# Altium schematic sheet Power Stuff.SchDoc
size A4
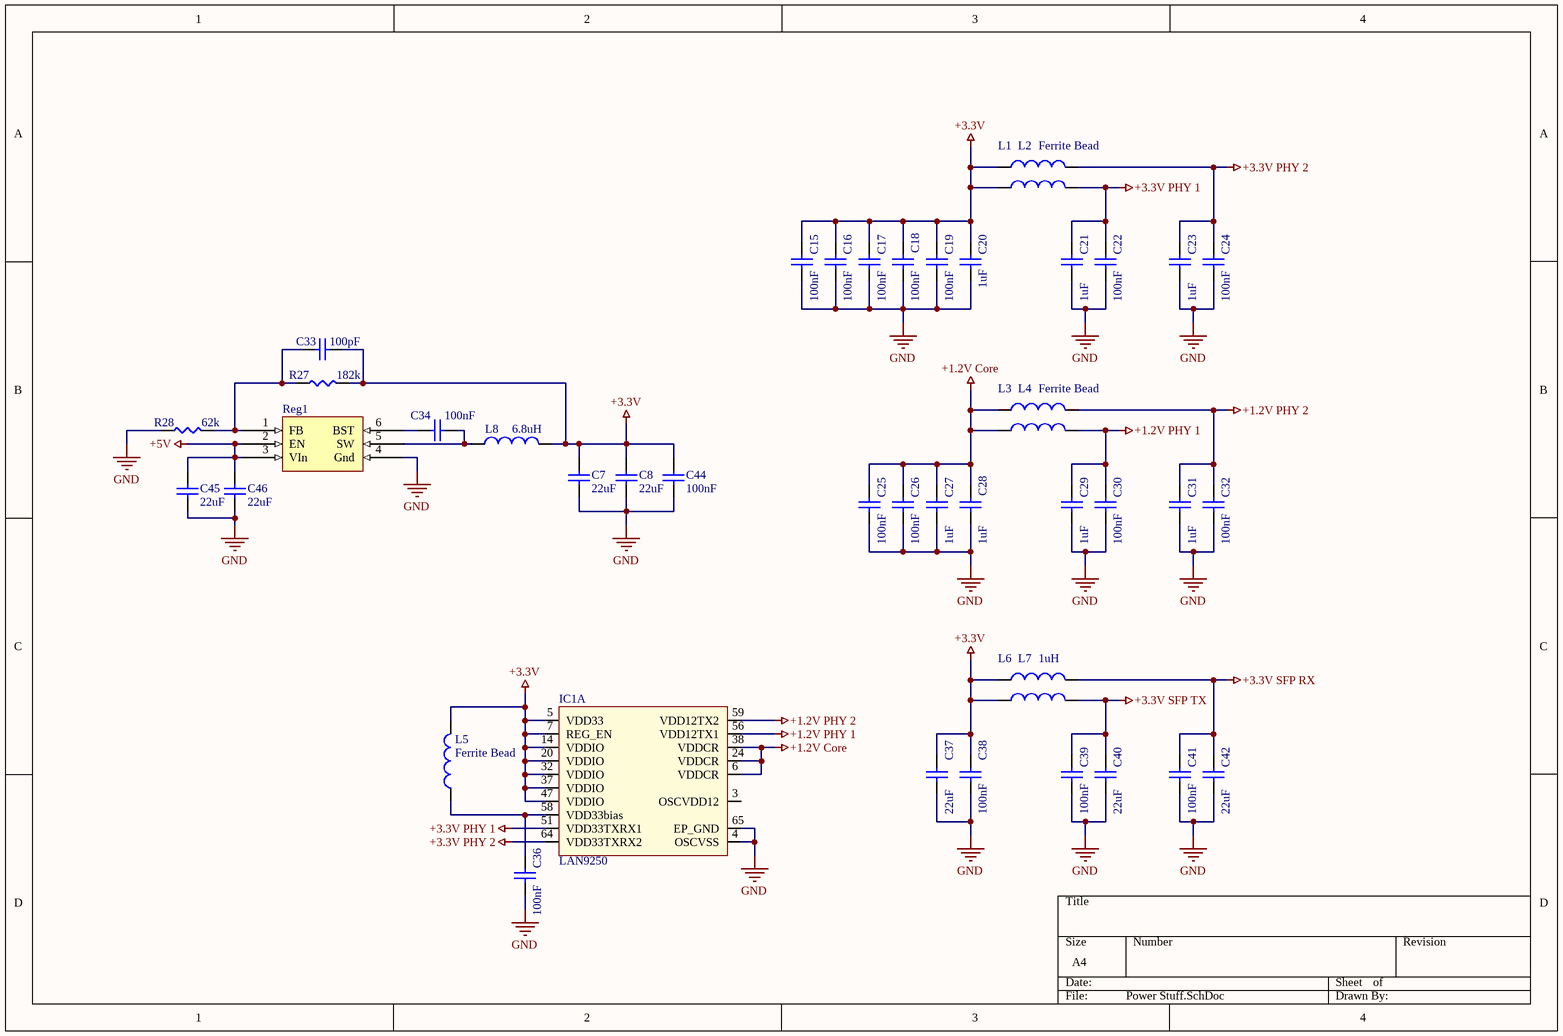
[diagram p0: Power Stuff.SchDoc]

## Parts
C7  22uF  [0603]
C8  22uF  [0603]
C15  100nF  [0402]
C16  100nF  [0402]
C17  100nF  [0402]
C18  100nF  [0402]
C19  100nF  [0402]
C20  1uF  [0402]
C21  1uF  [0402]
C22  100nF  [0402]
C23  1uF  [0402]
C24  100nF  [0402]
C25  100nF  [0402]
C26  100nF  [0402]
C27  1uF  [0402]
C28  1uF  [0402]
C29  1uF  [0402]
C30  100nF  [0402]
C31  1uF  [0402]
C32  100nF  [0402]
C33  100pF  [0402]
C34  100nF  [0402]
C36  100nF  [0402]
C37  22uF  [0603]
C38  100nF  [0402]
C39  100nF  [0402]
C40  22uF  [0603]
C41  100nF  [0402]
C42  22uF  [0603]
C44  100nF  [0402]
C45  22uF  [0603]
C46  22uF  [0603]
IC1  LAN9250  [QFN64]  (part A of 5)
L1  Ferrite Bead  [0402]
L2  Ferrite Bead  [0402]  (value not drawn)
L3  Ferrite Bead  [0402]
L4  Ferrite Bead  [0402]  (value not drawn)
L5  Ferrite Bead  [0402]
L6  1uH  [0603]
L7  1uH  [0603]  (value not drawn)
L8  6.8uH  [1008]
R27  182k  [0402]
R28  62k  [0402]
Reg1  Buck regulator  [TSOT26]  (value not drawn)

## Nets
+1.2V Core: C25.1 C26.1 C27.1 C28.1 IC1.6(VDDCR) IC1.24(VDDCR) IC1.38(VDDCR) L3.1 L4.1
+1.2V PHY 1: C29.1 C30.1 IC1.56(VDD12TX1) L4.2
+1.2V PHY 2: C31.1 C32.1 IC1.59(VDD12TX2) L3.2
+3.3V: C7.1 C8.1 C15.1 C16.1 C17.1 C18.1 C19.1 C20.1 C33.1 C37.1 C38.1 C44.1 IC1.5(VDD33) IC1.7(REG_EN) IC1.14(VDDIO) IC1.20(VDDIO) IC1.32(VDDIO) IC1.37(VDDIO) IC1.47(VDDIO) L1.1 L2.1 L5.2 L6.1 L7.1 L8.2 R27.2
+3.3V PHY 1: C21.1 C22.1 IC1.51(VDD33TXRX1) L2.2
+3.3V PHY 2: C23.1 C24.1 IC1.64(VDD33TXRX2) L1.2
+3.3V SFP RX: C41.1 C42.1 L6.2
+3.3V SFP TX: C39.1 C40.1 L7.2
+5V: C45.2 C46.1 Reg1.2(EN) Reg1.3(VIn)
GND: C7.2 C8.2 C15.2 C16.2 C17.2 C18.2 C19.2 C20.2 C21.2 C22.2 C23.2 C24.2 C25.2 C26.2 C27.2 C28.2 C29.2 C30.2 C31.2 C32.2 C36.2 C37.2 C38.2 C39.2 C40.2 C41.2 C42.2 C44.2 C45.1 C46.2 IC1.4(OSCVSS) IC1.65(EP_GND) R28.1 Reg1.4(Gnd)
NetC33_2: C33.2 R27.1 R28.2 Reg1.1(FB)
NetC34_1: C34.1 Reg1.6(BST)
NetC34_2: C34.2 L8.1 Reg1.5(SW)
NetC36_1: C36.1 IC1.58(VDD33bias) L5.1

Not connected (* = marked no-connect by the designer): IC1 3(OSCVDD12)

## Library data of the parts
C7 C8 C15-C34 C36-C42 C44-C46 = Cap: Supplier 1: Digi-Key; Supplier 2: Digi-Key; Supplier 3: Digi-Key; Supplier Part Number 1: 1276-2044-1-ND; Supplier Part Number 2: 1276-1018-1-ND; Supplier Part Number 3: 1276-1182-1-ND; Supplier 4: Digi-Key; Supplier 5: Digi-Key; Supplier 6: Digi-Key; Supplier 7: Digi-Key; Supplier 8: Digi-Key; Supplier 9: Digi-Key; Supplier Part Number 4: 1276-1009-1-ND; Supplier Part Number 5: 1276-1098-1-ND; Supplier Part Number 6: 1276-1119-1-ND; Supplier Part Number 7: 490-12737-1-ND; Supplier Part Number 9: 587-1249-1-ND; Supplier Part Number 8: 1276-1183-1-ND; Supplier 10: Digi-Key; Supplier 11: Digi-Key; Supplier 12: Digi-Key; Supplier 13: Digi-Key; Supplier Part Number 10: 1276-CL10B104KB8NNNLCT-ND; Supplier Part Number 11: 399-1085-1-ND; Supplier Part Number 13: 587-2985-1-ND; Supplier Part Number 12: 1276-1021-1-ND; Supplier 14: Digi-Key; Supplier 15: Digi-Key; Supplier 16: Digi-Key; Supplier 17: Digi-Key; Supplier 18: Digi-Key; Supplier 19: Digi-Key; Supplier Part Number 14: 490-14603-1-ND; Supplier Part Number 15: 311-3700-1-ND; Supplier Part Number 16: 311-1042-1-ND; Supplier Part Number 17: 311-1415-1-ND; Supplier Part Number 19: 587-4321-1-ND; Supplier Part Number 18: 1276-1907-1-ND; Supplier 20: Digi-Key; Supplier 21: Digi-Key; Supplier 22: Digi-Key; Supplier Part Number 20: 1276-6767-1-ND; Supplier Part Number 21: 1276-7060-1-ND; Supplier Part Number 22: 311-1084-1-ND
IC1 = LAN9250: 10/100 Ethernet controller & PHY; ComponentLink1Description: Datasheet; ComponentLink1URL: https://ww1.microchip.com/downloads/en/DeviceDoc/00001913A.pdf; Supplier 1: Digi-Key; Supplier Part Number 1: LAN9250/ML-ND
L1-L8 = Inductor: Supplier 1: Digi-Key; Supplier 2: Digi-Key; Supplier Part Number 1: 541-1250-1-ND; Supplier Part Number 2: 541-1253-1-ND; Supplier 3: Digi-Key; Supplier 4: Digi-Key; Supplier Part Number 3: SRN6028-3R9MCT-ND; Supplier Part Number 4: SRN6028-4R7MCT-ND; Supplier 5: Digi-Key; Supplier Part Number 5: 490-10563-1-ND; Supplier 6: Digi-Key; Supplier 7: Digi-Key; Supplier 8: Digi-Key; Supplier 9: Digi-Key; Supplier Part Number 6: 1276-6932-1-ND; Supplier Part Number 7: 587-2042-1-ND; Supplier Part Number 9: SRP1265A-1R0MCT-ND; Supplier Part Number 8: 535-12790-1-ND; Supplier 10: Digi-Key; Supplier Part Number 10: SRP1770TA-5R6MCT-ND; Supplier 11: Digi-Key; Supplier Part Number 11: SRN6028-100MCT-ND
  L1-L7: Supplier 12: Digi-Key; Supplier Part Number 12: SRN2510F-2R2MCT-ND; Supplier 13: Digi-Key; Supplier Part Number 13: 490-3992-1-ND
R27 R28 = Resistor
Reg1 = AP6320: Supplier 1: Digi-Key; Supplier Part Number 1: AP63203WU-7DICT-ND; Supplier 2: Digi-Key; Supplier Part Number 2: AP63200WU-7DICT-ND; Supplier 3: Digi-Key; Supplier Part Number 3: AP63201WU-7DICT-ND